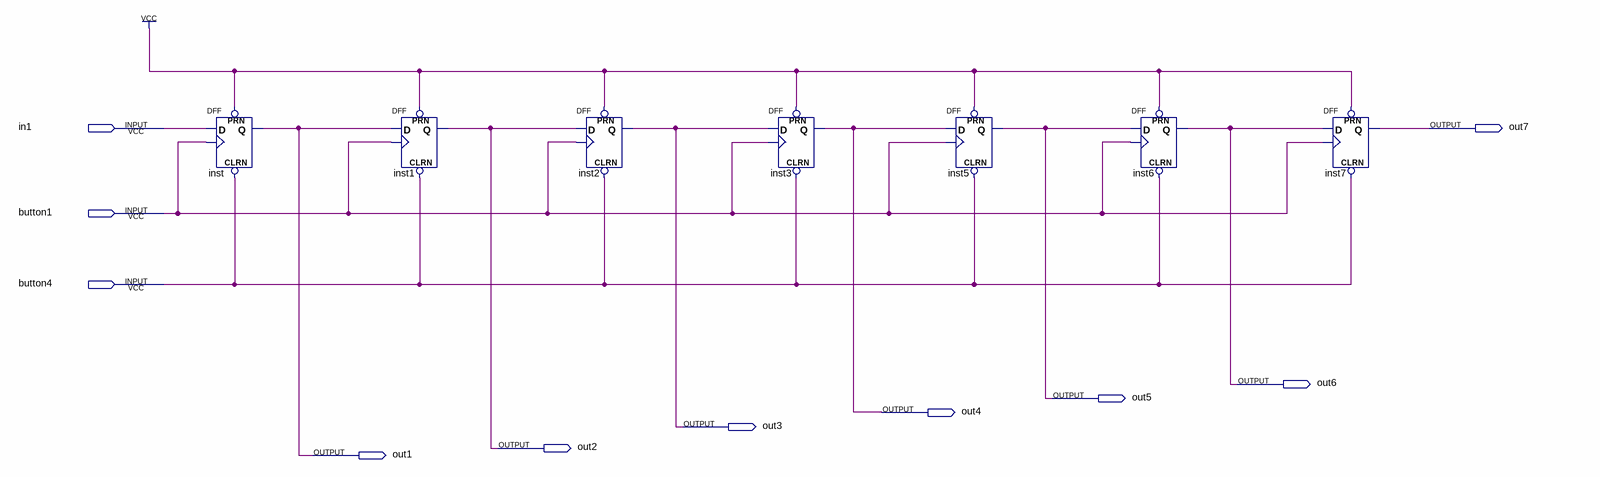
[diagram p0: schematic sheet]
// Quartus schematic ShiftRegisterSIPO_7bit.bdf as structural Verilog: 7 symbols, 10 pins
module ShiftRegisterSIPO_7bit (
  input  in1,
  input  button1,
  input  button4,
  output out7,
  output out6,
  output out5,
  output out4,
  output out3,
  output out2,
  output out1
);

  DFF inst (.CLRN(button4), .CLK(button1), .D(in1), .PRN(1'b1), .Q(out1));
  DFF inst1 (.CLRN(button4), .CLK(button1), .D(out1), .PRN(1'b1), .Q(out2));
  DFF inst2 (.CLRN(button4), .CLK(button1), .D(out2), .PRN(1'b1), .Q(out3));
  DFF inst3 (.CLRN(button4), .CLK(button1), .D(out3), .PRN(1'b1), .Q(out4));
  DFF inst5 (.CLRN(button4), .CLK(button1), .D(out4), .PRN(1'b1), .Q(out5));
  DFF inst6 (.CLRN(button4), .CLK(button1), .D(out5), .PRN(1'b1), .Q(out6));
  DFF inst7 (.CLRN(button4), .CLK(button1), .D(out6), .PRN(1'b1), .Q(out7));
endmodule
